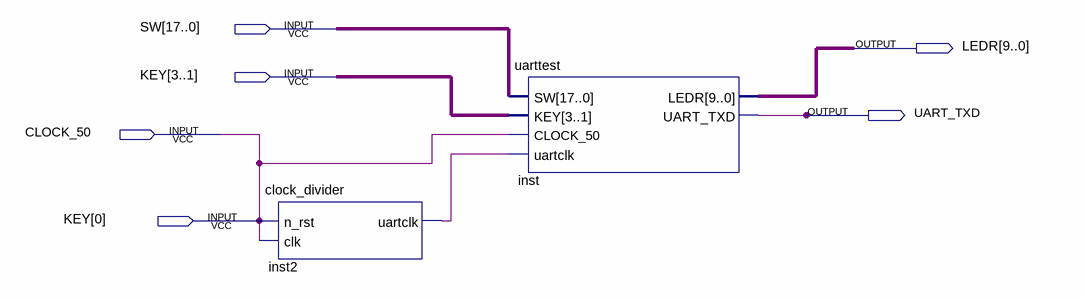
[diagram p0: schematic sheet]
// Quartus schematic uart_tester.bdf as structural Verilog: 2 symbols, 6 pins
module uart_tester (
  input  [17:0] SW,
  input  [3:0] KEY,
  input  CLOCK_50,
  output [9:0] LEDR,
  output UART_TXD
);

  wire inst2_uartclk;

  clock_divider inst2 (.n_rst(CLOCK_50), .clk(CLOCK_50), .uartclk(inst2_uartclk));
  uarttest inst (
    .SW(SW), .KEY(KEY[3:1]), .CLOCK_50(CLOCK_50), .uartclk(inst2_uartclk), .LEDR(LEDR), .UART_TXD(UART_TXD));

  assign KEY[0] = CLOCK_50;
endmodule
